# Altium schematic sheet Power2.SchDoc
size A4
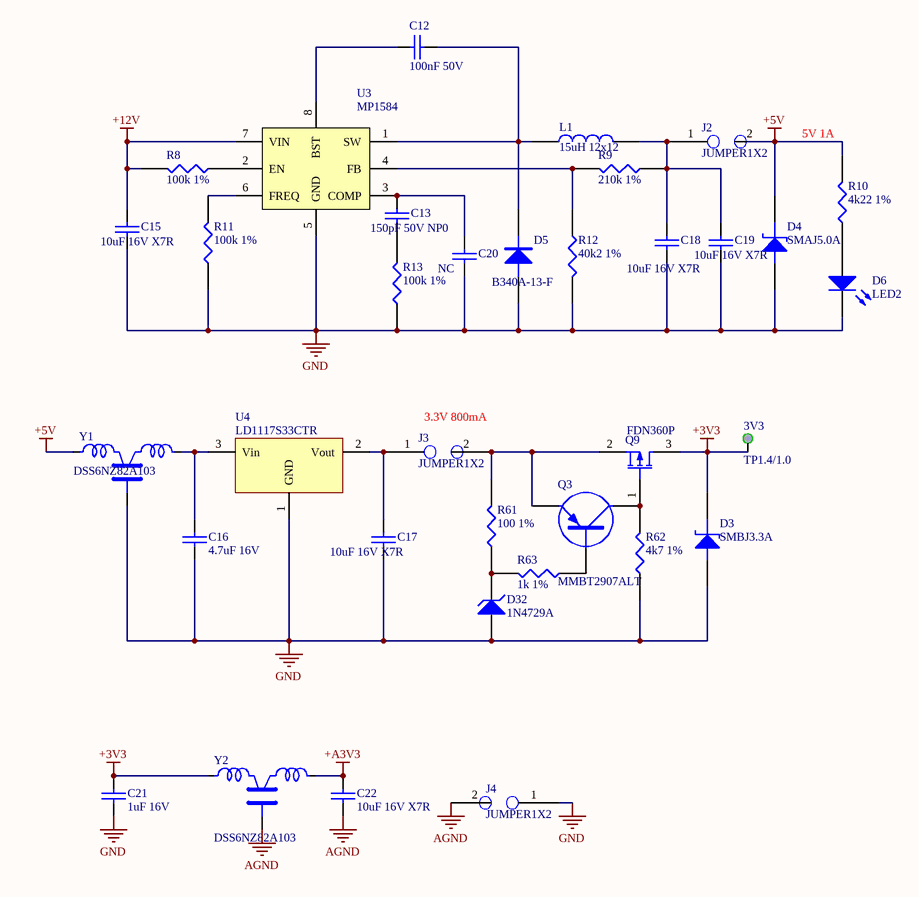
[diagram p0: Power2.SchDoc]

## Parts
3V3  TP1.4/1.0  [TP1.4/1.0]  (no BOM)
C12  100nF 50V  [CAPC2012N]
C13  150pF 50V NP0  [CAPC2012N]
C15  10uF 16V X7R  [CAPC3216N]
C16  4.7uF 16V  [CAPC2012N]
C17  10uF 16V X7R  [CAPC3216N]
C18  10uF 16V X7R  [CAPC3216N]
C19  10uF 16V X7R  [CAPC3216N]
C20  NC  [CAPC2012N]  (no BOM)
C21  1uF 16V  [CAPC2012N]
C22  10uF 16V X7R  [CAPC3216N]
D3  SMBJ3.3A  [DSO-C2/X2.3]
D4  SMAJ5.0A  [DSO-C2/G1.6]
D5  B340A-13-F  [DSO-C2/G1.6]
D6  LED2  [3.2X1.6X1.1]
D32  1N4729A  [DIO10.36-5.2x2.8]
J2  JUMPER1X2  [JP-SOLDER-H1X2-3X2]  (no BOM)
J3  JUMPER1X2  [JP-SOLDER-H1X2-3X2]  (no BOM)
J4  JUMPER1X2  [JP-SOLDER-H1X2-3X2]  (no BOM)
L1  15uH 12x12  [IN-12.2X12.2MM]
Q3  MMBT2907ALT  [SOT23-3N]
Q9  FDN360P  [SOT23-3N]
R8  100k 1%  [RESC2012N]
R9  210k 1%  [RESC2012N]
R10  4k22 1%  [RESC2012N]
R11  100k 1%  [RESC2012N]
R12  40k2 1%  [RESC2012N]
R13  100k 1%  [RESC2012N]
R61  100 1%  [RESC2012N]
R62  4k7 1%  [RESC2012N]
R63  1k 1%  [RESC2012N]
U3  MP1584  [SOIC8E]
U4  LD1117S33CTR  [SOT223-4M]
Y1  DSS6NZ82A103  [DSS6]
Y2  DSS6NZ82A103  [DSS6]

## Nets
+3V3: 3V3.1 C21.1 D3.2(K) Q9.3(D) Y2.1
+5V: D4.2(K) J2.2 R10.2 Y1.1
+12V: C15.1 R8.2 U3.7(VIN)
+A3V3: C22.1 Y2.3
AGND: C22.2 J4.2 Y2.2
GND: C15.2 C16.2 C17.2 C18.2 C19.2 C20.2 C21.2 D3.1(A) D4.1(A) D5.1(A) D6.2(K) D32.1(A) J4.1 R11.1 R12.2 R13.1 R62.1 U3.5(GND) U4.1(GND) Y1.2
NetC12_1: C12.1 U3.8(BST)
NetC12_2: C12.2 D5.2(K) L1.1 U3.1(SW)
NetC13_1: C13.1 C20.1 U3.3(COMP)
NetC13_2: C13.2 R13.2
NetC16_1: C16.1 U4.3(Vin) Y1.3
NetC17_1: C17.1 J3.1 U4.2(Vout)
NetC18_1: C18.1 C19.1 J2.1 L1.2 R9.1
NetD6_1: D6.1(A) R10.1
NetD32_2: D32.2(K) R61.1 R63.2
NetJ3_2: J3.2 Q3.2(E) Q9.2(S) R61.2
NetQ3_1: Q3.1(B) R63.1
NetQ3_3: Q3.3(C) Q9.1(G) R62.2
NetR8_1: R8.1 U3.2(EN)
NetR9_2: R9.2 R12.1 U3.4(FB)
NetR11_2: R11.2 U3.6(FREQ)

## Notes on the sheet
- (near R10) 5V 1A
- (near J3) 3.3V 800mA

## Library data of the parts
C12 C13 C17-C20 = CAP: Price: 0.025
C15 C16 C21 C22 = CAP: Capacitor; Price: 0.025
D3 D4 = ZENER2: Zener Diode; Manufacturer: Vishay; Price: 0.65
D5 = DIODE: Zener Diode 3A 40V; Price: 0.4
D6 = LED2: Typical RED, GREEN, YELLOW, AMBER GaAs LED; Published: 8-Jun-2000; LatestRevisionDate: 17-Jul-2002; LatestRevisionNote: Re-released for DXP Platform.; PackageDocument: Feb-2002; PackageReference: 3.2X1.6X1.1; Publisher: Altium Limited
D32 = D Zener: Zener Diode; Published: 8-Jun-2000; LatestRevisionDate: 17-Jul-2002; LatestRevisionNote: Re-released for DXP Platform.; PackageReference: DIODE-0.7; Publisher: Altium Limited
L1 = INDUCTOR: Inductor 3A
Q3 = MMBT3906: PNP transitor; Price: 0.25
Q9 = MOSFET-P: P-Channel MOSFET; PackageDocument: 1995/1996; Published: 8-Jun-2000; LatestRevisionDate: 17-Jul-2002; LatestRevisionNote: Re-released for DXP Platform.; PackageReference: E3; Publisher: Altium Limited
R8-R13 R61-R63 = RES1
U3 = MP1584: 3A 1.5MHz, 28V step down converter; Manufacturer: MSP; Price: *
U4 = VOLTREG: ST Low drop voltage regulator; Price: 1.5; Manufacturer: ST
Y1 Y2 = DSS6: Murata EMI suppression filter; Manufacturer: Murata; Price: 0.5